# Altium schematic sheet Step-Up converter.SchDoc
size A3; SheetNumber: 3; SheetTotal: 7
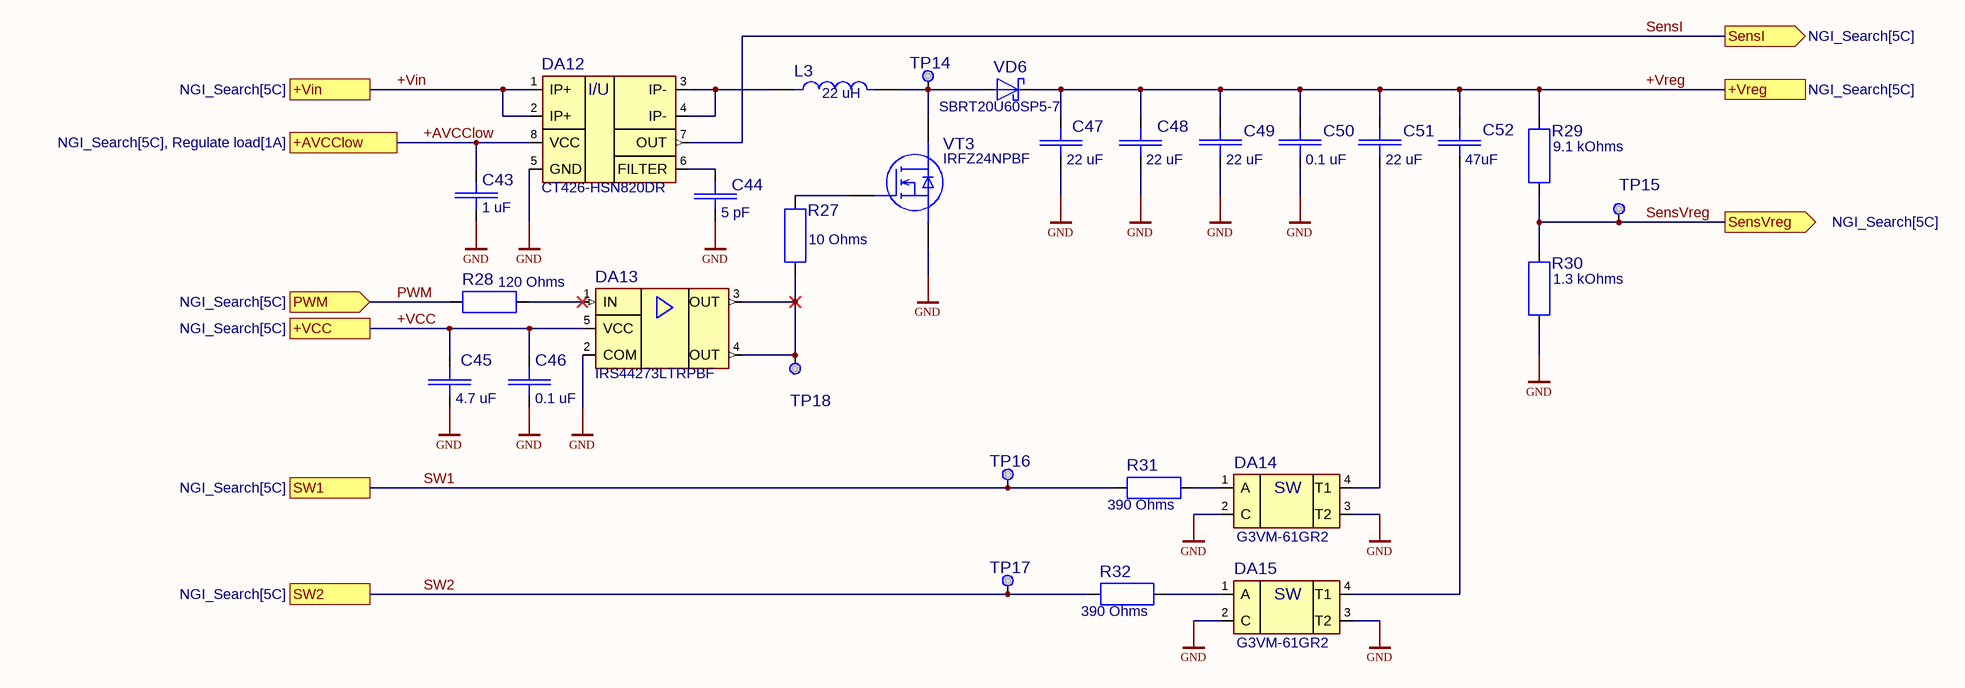
[diagram p0: Step-Up converter.SchDoc]

## Parts
C43  value 1 uF  [Capacitor0805_THICKNESS1.25]  (hidden comment: CL21B105KAFNFNE)
C44  value 5 pF  [Capacitor0805_THICKNESS0.6]  (hidden comment: CC0805CRNPO9BN5R0)
C45  value 4.7 uF  [Capacitor0805_THICKNESS1.25]  (hidden comment: CL21A475KAQNNNF)
C46  value 0.1 uF  [Capacitor0805_THICKNESS0.8]  (hidden comment: CL21B104KBCNNWC)
C47  value 22 uF  [Capacitor1206_THICKNESS1.6]  (hidden comment: C3216X5R1V226M160AC)
C48  value 22 uF  [Capacitor1206_THICKNESS1.6]  (hidden comment: C3216X5R1V226M160AC)
C49  value 22 uF  [Capacitor1206_THICKNESS1.6]  (hidden comment: C3216X5R1V226M160AC)
C50  value 0.1 uF  [Capacitor0805_THICKNESS0.8]  (hidden comment: CL21B104KBCNNWC)
C51  value 22 uF  [Capacitor1206_THICKNESS1.6]  (hidden comment: C3216X5R1V226M160AC)
C52  value 47uF  [Capacitor2220_THICKNESS3.1]  (hidden comment: C5750X7R1V476M230KC)
DA12  CT426-HSN820DR  [SOIC-8]
DA13  IRS44273LTRPBF  [SOT-23 5pin]
DA14  G3VM-61GR2  [SOP-4]
DA15  G3VM-61GR2  [SOP-4]
L3  value 22 uH  [PA4343.223ANLT_Footprint 2]  (hidden comment: PA4343.223ANLT)
R27  value 10 Ohms  [Resistor0805_THICKNESS0.6]  (hidden comment: RE0805FRE0710RL)
R28  value 120 Ohms  [Resistor0805_THICKNESS0.6]  (hidden comment: RC0805FR-07120RL)
R29  value 9.1 kOhms  [Resistor0805_THICKNESS0.6]  (hidden comment: RC0805FR-079K1L)
R30  value 1.3 kOhms  [Resistor0805_THICKNESS0.6]  (hidden comment: RC0805FR-101K3L)
R31  value 390 Ohms  [Resistor0805_THICKNESS0.6]  (hidden comment: RC0805FR-07390RL)
R32  value 390 Ohms  [Resistor0805_THICKNESS0.6]  (hidden comment: RC0805FR-07390RL)
TP14  test point  [test point]  (value not drawn)
TP15  test point  [test point]  (value not drawn)
TP16  test point  [test point]  (value not drawn)
TP17  test point  [test point]  (value not drawn)
TP18  test point  [test point]  (value not drawn)
VD6  SBRT20U60SP5-7  [PowerDI5-3]
VT3  IRFZ24NPBF  [IRFZ24NPBF TO-220 with HS FA-T220-64E]

## Ports
+AVCClow (see NGI_Search[5C], Regulate load[1A]), +VCC (see NGI_Search[5C]), +Vin (see NGI_Search[5C]), +Vreg (see NGI_Search[5C]), PWM (in, see NGI_Search[5C]), SensI (out, see NGI_Search[5C]), SensVreg (out, see NGI_Search[5C]), SW1 (see NGI_Search[5C]), SW2 (see NGI_Search[5C])

## Nets
GND: C43.2 C44.1 C45.1 C46.1 C47.1 C48.1 C49.2 C50.2 DA12.5(GND) DA13.2(COM) DA14.2(C) DA14.3(T2) DA15.2(C) DA15.3(T2) R30.1 VT3.3(S)
+AVCClow: C43.1 DA12.8(VCC) ; port +AVCClow
+VCC: C45.2 C46.2 DA13.5(VCC) ; port +VCC
+Vin: DA12.1(IP+) DA12.2(IP+) ; port +Vin
+Vreg: C47.2 C48.2 C49.1 C50.1 C51.1 C52.2 R29.2 VD6.C ; port +Vreg
PWM: R28.1 ; port PWM
SensI: DA12.7(OUT) ; port SensI
SensVreg: R29.1 R30.2 TP15.1 ; port SensVreg
SW1: R31.1 TP16.1 ; port SW1
SW2: R32.1 TP17.1 ; port SW2
NetC44_2: C44.2 DA12.6(FILTER)
NetC51_2: C51.2 DA14.4(T1)
NetC52_1: C52.1 DA15.4(T1)
NetDA12_3: DA12.3(IP-) DA12.4(IP-) L3.1
NetDA13_1: DA13.1(IN) R28.2
NetDA13_3: DA13.3(OUT) DA13.4(OUT) R27.1 TP18.1
NetDA14_1: DA14.1(A) R31.2
NetDA15_1: DA15.1(A) R32.2
NetL3_2: L3.2 TP14.1 VD6.A1 VT3.2(D)
NetR27_2: R27.2 VT3.1(G)

Not connected (* = marked no-connect by the designer): VD6 A2

## Notes on the sheet
- (in symbol CT426-HSN820DR) I/U
- (in symbol G3VM-61GR2) SW

## Library data of the parts
C43 = CL21B105KAFNFNE: Multilayer Ceramic Capacitors MLCC - SMD/SMT 1uF+/-10% 25V X7R 20 0805; Manufacturer: Samsung Electro-Mechanics; Tolerance: 10%; Case: 0805; Datasheet Link: https://eu.mouser.com/datasheet/2/585/MLCC-1837944.pdf; Dielectric: X7R; ManufacturerPartNumber: CL21B105KAFNFNE; Mouser Part Number: 187-CL21B105KAFNFNE; Mouser Price/Stock: https://eu.mouser.com/ProductDetail/Samsung-Electro-Mechanics/CL21B105KAFNFNE?qs=%252B6g0mu59x7LIqMOGGtEcpA%3D%3D; Power/Voltage: 25V
C44 = CC0805CRNPO9BN5R0: Multilayer Ceramic Capacitors MLCC - SMD/SMT 50V 5pF C0G 0805 Tol 0.25pF; Manufacturer: YAGEO; Dielectric: C0G (NP0); Tolerance: 5%; Case: 0805; Datasheet Link: https://eu.mouser.com/datasheet/2/447/UPY_NP0X5R_01005_4V_to_25V_V10-3003057.pdf; ManufacturerPartNumber: CC0805CRNPO9BN5R0; Mouser Part Number: 603-CC805CRNPO9BN5R0; Mouser Price/Stock: https://eu.mouser.com/ProductDetail/YAGEO/CC0805CRNPO9BN5R0?qs=57cj7OiSijm1o7wMqGKW1g%3D%3D; Power/Voltage: 50V
C45 = CL21A475KAQNNNF: Multilayer Ceramic Capacitors MLCC - SMD/SMT 4.7uF+/-10% 25V X5R 0805; Manufacturer: Samsung Electro-Mechanics; Tolerance: 10%; Case: 0805; Datasheet Link: https://eu.mouser.com/datasheet/2/585/MLCC-1837944.pdf; Dielectric: X5R; ManufacturerPartNumber: CL21A475KAQNNNF; Mouser Part Number: 187-CL21A475KAQNNNF; Mouser Price/Stock: https://eu.mouser.com/ProductDetail/Samsung-Electro-Mechanics/CL21A475KAQNNNF?qs=sGAEpiMZZMvsSlwiRhF8qtsGU%2FCnaNeQ9%2FtqxdEQLsBh1lK0%252BjEvRQ%3D%3D; Power/Voltage: 25V
C46 C50 = CL21B104KBCNNWC: Multilayer Ceramic Capacitors MLCC - SMD/SMT 100nF+/-10% 50V X7R 0805; Manufacturer: Samsung Electro-Mechanics; Tolerance: 10%; Dielectric: X7R; ManufacturerPartNumber: CL21B104KBCNNWC; Mouser Price/Stock: https://eu.mouser.com/ProductDetail/Samsung-Electro-Mechanics/CL21B104KBCNNWC?qs=yOVawPpwOwlu2UTVxWhmlw%3D%3D; Power/Voltage: 50V; Case: 0805; Datasheet Link: https://eu.mouser.com/datasheet/2/585/MLCC-1837944.pdf; Mouser Part Number: 187-CL21B104KBCNNWC
C47-C49 C51 = C3216X5R1V226M160AC: Multilayer Ceramic Capacitors MLCC - SMD/SMT 1206 35V 22uF X5R 20% T: 1.6mm; Manufacturer: TDK; Case: 1206; Datasheet Link: https://product.tdk.com/system/files/dam/doc/product/capacitor/ceramic/mlcc/catalog/mlcc_commercial_general_en.pdf; Dielectric: X5R; ManufacturerPartNumber: C3216X5R1V226M160AC; Mouser Part Number: 810-C3216X5R1V226M; Mouser Price/Stock: https://eu.mouser.com/ProductDetail/TDK/C3216X5R1V226M160AC?qs=NRhsANhppD8TwN31eZ1xGQ%3D%3D; Power/Voltage: 35V; Tolerance: 20%
C52 = C5750X7R1V476M230KC: Multilayer Ceramic Capacitors MLCC - SMD/SMT 2220 35VDC 47uF 20% X7R; Manufacturer: TDK; Power/Voltage: 35V; Case: 2220; Datasheet Link: https://product.tdk.com/system/files/dam/doc/product/capacitor/ceramic/mlcc/catalog/mlcc_commercial_general_en.pdf; Dielectric: X7R; ManufacturerPartNumber: C5750X7R1V476M230KC; Mouser Part Number: 810-C5750X7R1V476M23; Mouser Price/Stock: https://eu.mouser.com/ProductDetail/TDK/C5750X7R1V476M230KC?qs=rSMjJ%252B1ewcSIfs95ZgB3Sw%3D%3D; Tolerance: 20%
DA12 = CT426-HSN820DR: Board Mount Current Sensors XtremeSense TMR Ultra-Low Noise, 8-lead SOIC (20 ADC; VDD = 3.3 V; Up to +125C); Manufacturer: Crocus Technology; Case: SOIC-8; Datasheet Link: https://eu.mouser.com/datasheet/2/779/CT426_Data_Sheet_Rev0_7-2934570.pdf; ManufacturerPartNumber: CT426-HSN820DR; Mouser Part Number: 462-CT426-HSN820DR; Mouser Price/Stock: https://eu.mouser.com/ProductDetail/Crocus/CT426-HSN820DR?qs=7D1LtPJG0i3u5AJ0mZ7fbw%3D%3D
DA13 = IRS44273LTRPBF: Gate Drivers 25V 1-CH low-side 1.5A,Single input; Manufacturer: Infineon; Case: SOT-23 5pin; Datasheet Link: https://eu.mouser.com/datasheet/2/196/Infineon_IRS44273L_DS_v01_00_EN-3363539.pdf; ManufacturerPartNumber: IRS44273LTRPBF; Mouser Part Number: 942-IRS44273LTRPBF; Mouser Price/Stock: https://eu.mouser.com/ProductDetail/Infineon-Technologies/IRS44273LTRPBF?qs=mm%2F7efQvNxqxS8rwPY9f8Q%3D%3D
DA14 DA15 = G3VM-61GR2: Solid State Relays - PCB Mount 60V,1.7A, 80mOhm ONr 1 Form A, SOP4/SMT; Manufacturer: Omron; Case: SOP-4; Datasheet Link: https://eu.mouser.com/datasheet/2/307/en-g3vm_61gr2-780127.pdf; ManufacturerPartNumber: G3VM-61GR2; Mouser Part Number: 653-G3VM61GR2; Mouser Price/Stock: https://eu.mouser.com/ProductDetail/Omron-Electronics/G3VM-61GR2?qs=ycOx5YLpuFVseArz%252BUpyOA%3D%3D
L3 = PA4343.223ANLT: Power Inductors - SMD 22uH 8A 6.5mm 20% SMT; Manufacturer: Pulse Electronics; Maximum Current: 10 A; Maximum Resistance: 35 mOhms; Case: Footprint 2; Datasheet Link: https://eu.mouser.com/datasheet/2/447/pulse_plei_s_a0011300682_1-2904644.pdf; ManufacturerPartNumber: PA4343.223ANLT; Mouser Part Number: 673-PA4343.223ANLT; Mouser Price/Stock: https://eu.mouser.com/ProductDetail/Pulse-Electronics/PA4343.223ANLT?qs=chTDxNqvsynRNYLFa1aovw%3D%3D; Tolerance: 20%
R27 = RE0805FRE0710RL: Thick Film Resistors 10 Ohms 125 mW 0805 1%; Manufacturer: YAGEO; Power/Voltage: 125 mW / 150V; Case: 0805; Datasheet Link: https://eu.mouser.com/datasheet/2/447/PYu_RE_105_RoHS_L_6-3003059.pdf; ManufacturerPartNumber: RE0805FRE0710RL; Mouser Part Number: 603-RE0805FRE0710RL; Mouser Price/Stock: https://eu.mouser.com/ProductDetail/YAGEO/RE0805FRE0710RL?qs=sGAEpiMZZMvdGkrng054txKsa61JPVaKU6lpEP28x7tdTAAdaUzZLA%3D%3D; Tolerance: 1%
R28 = RC0805FR-07120RL: Thick Film Resistors 120 Ohms 125 mW 0805 1%; Manufacturer: YAGEO; Power/Voltage: 125 mW / 150V; ManufacturerPartNumber: RC0805FR-07120RL; Tolerance: 1%; Case: 0805; Mouser Price/Stock: https://eu.mouser.com/ProductDetail/YAGEO/RC0805FR-07120RL?qs=sGAEpiMZZMvdGkrng054t8Tx25L%252BvTaRzcdZIgz1A9Y%3D; Datasheet Link: https://eu.mouser.com/datasheet/2/447/YAGEO_PYu_RC_Group_51_RoHS_L_12-3313492.pdf; Mouser Part Number: 603-RC0805FR-07120RL
R29 = RC0805FR-079K1L: Thick Film Resistors 9.1 kOhms 125 mW 0805 1%; Manufacturer: YAGEO; Power/Voltage: 125 mW / 150V; ManufacturerPartNumber: RC0805FR-079K1L; Tolerance: 1%; Case: 0805; Mouser Price/Stock: https://eu.mouser.com/ProductDetail/YAGEO/RC0805FR-079K1L?qs=sGAEpiMZZMvdGkrng054t8AJgcdMkx7xQsgCDGWWsX0%3D; Datasheet Link: https://eu.mouser.com/datasheet/2/447/YAGEO_PYu_RC_Group_51_RoHS_L_12-3313492.pdf; Mouser Part Number: 603-RC0805FR-079K1L
R30 = RC0805FR-101K3L: Thick Film Resistors 1.3 kOhms 250 mW 0805 1%; Manufacturer: YAGEO; Power/Voltage: 250 mW / 150V; ManufacturerPartNumber: RC0805FR-101K3; Tolerance: 1%; Case: 0805; Mouser Price/Stock: https://eu.mouser.com/ProductDetail/YAGEO/RC0805FR-101K3L?qs=sGAEpiMZZMvdGkrng054tyq4809kW%252ByTH4crGNSozBI%3D; Datasheet Link: https://eu.mouser.com/datasheet/2/447/PYu_RC_Group_51_RoHS_L_11-1984063.pdf; Mouser Part Number: 603-RC0805FR-101K3L
R31 R32 = RC0805FR-07390RL: Thick Film Resistors 390 Ohms 125 mW 0805 1%; Manufacturer: YAGEO; Power/Voltage: 125 mW / 150V; Case: 0805; Datasheet Link: https://eu.mouser.com/datasheet/2/447/YAGEO_PYu_RC_Group_51_RoHS_L_12-3313492.pdf; ManufacturerPartNumber: RC0805FR-07390RL; Mouser Part Number: 603-RC0805FR-07390RL; Mouser Price/Stock: https://eu.mouser.com/ProductDetail/YAGEO/RC0805FR-07390RL?qs=sGAEpiMZZMvdGkrng054txsj74Bdh5mga79f2h4RYlI%3D; Tolerance: 1%
VD6 = SBRT20U60SP5-7: Schottky Diodes & Rectifiers 20A Trench SBR 100V 20A 0.70Vf 0.3mA; Manufacturer: Diodes Incorporated; Case: PowerDI5-3; Datasheet Link: https://eu.mouser.com/datasheet/2/115/DIOD_S_A0001069160_1-2541914.pdf; ManufacturerPartNumber: SBRT20U60SP5-7; Mouser Part Number: 621-SBRT20U60SP57; Mouser Price/Stock: https://eu.mouser.com/ProductDetail/Diodes-Incorporated/SBRT20U60SP5-7?qs=JtunSoW0QGHhdN393pOqEQ%3D%3D
VT3 = IRFZ24NPBF: MOSFT 55V 17A 70mOhm 13.3nC; Manufacturer: Infineon; Case: TO-220; Datasheet Link: https://eu.mouser.com/datasheet/2/196/Infineon_IRFZ24N_DataSheet_v01_01_EN-3363353.pdf; ManufacturerPartNumber: IRFZ24NPBF; Mouser Part Number: 942-IRFZ24NPBF; Mouser Price/Stock: https://eu.mouser.com/ProductDetail/Infineon-Technologies/IRFZ24NPBF?qs=9%252BKlkBgLFf0TQgSTtY4J0g%3D%3D